# EAGLE design R204B (EAGLE 6.6.0)
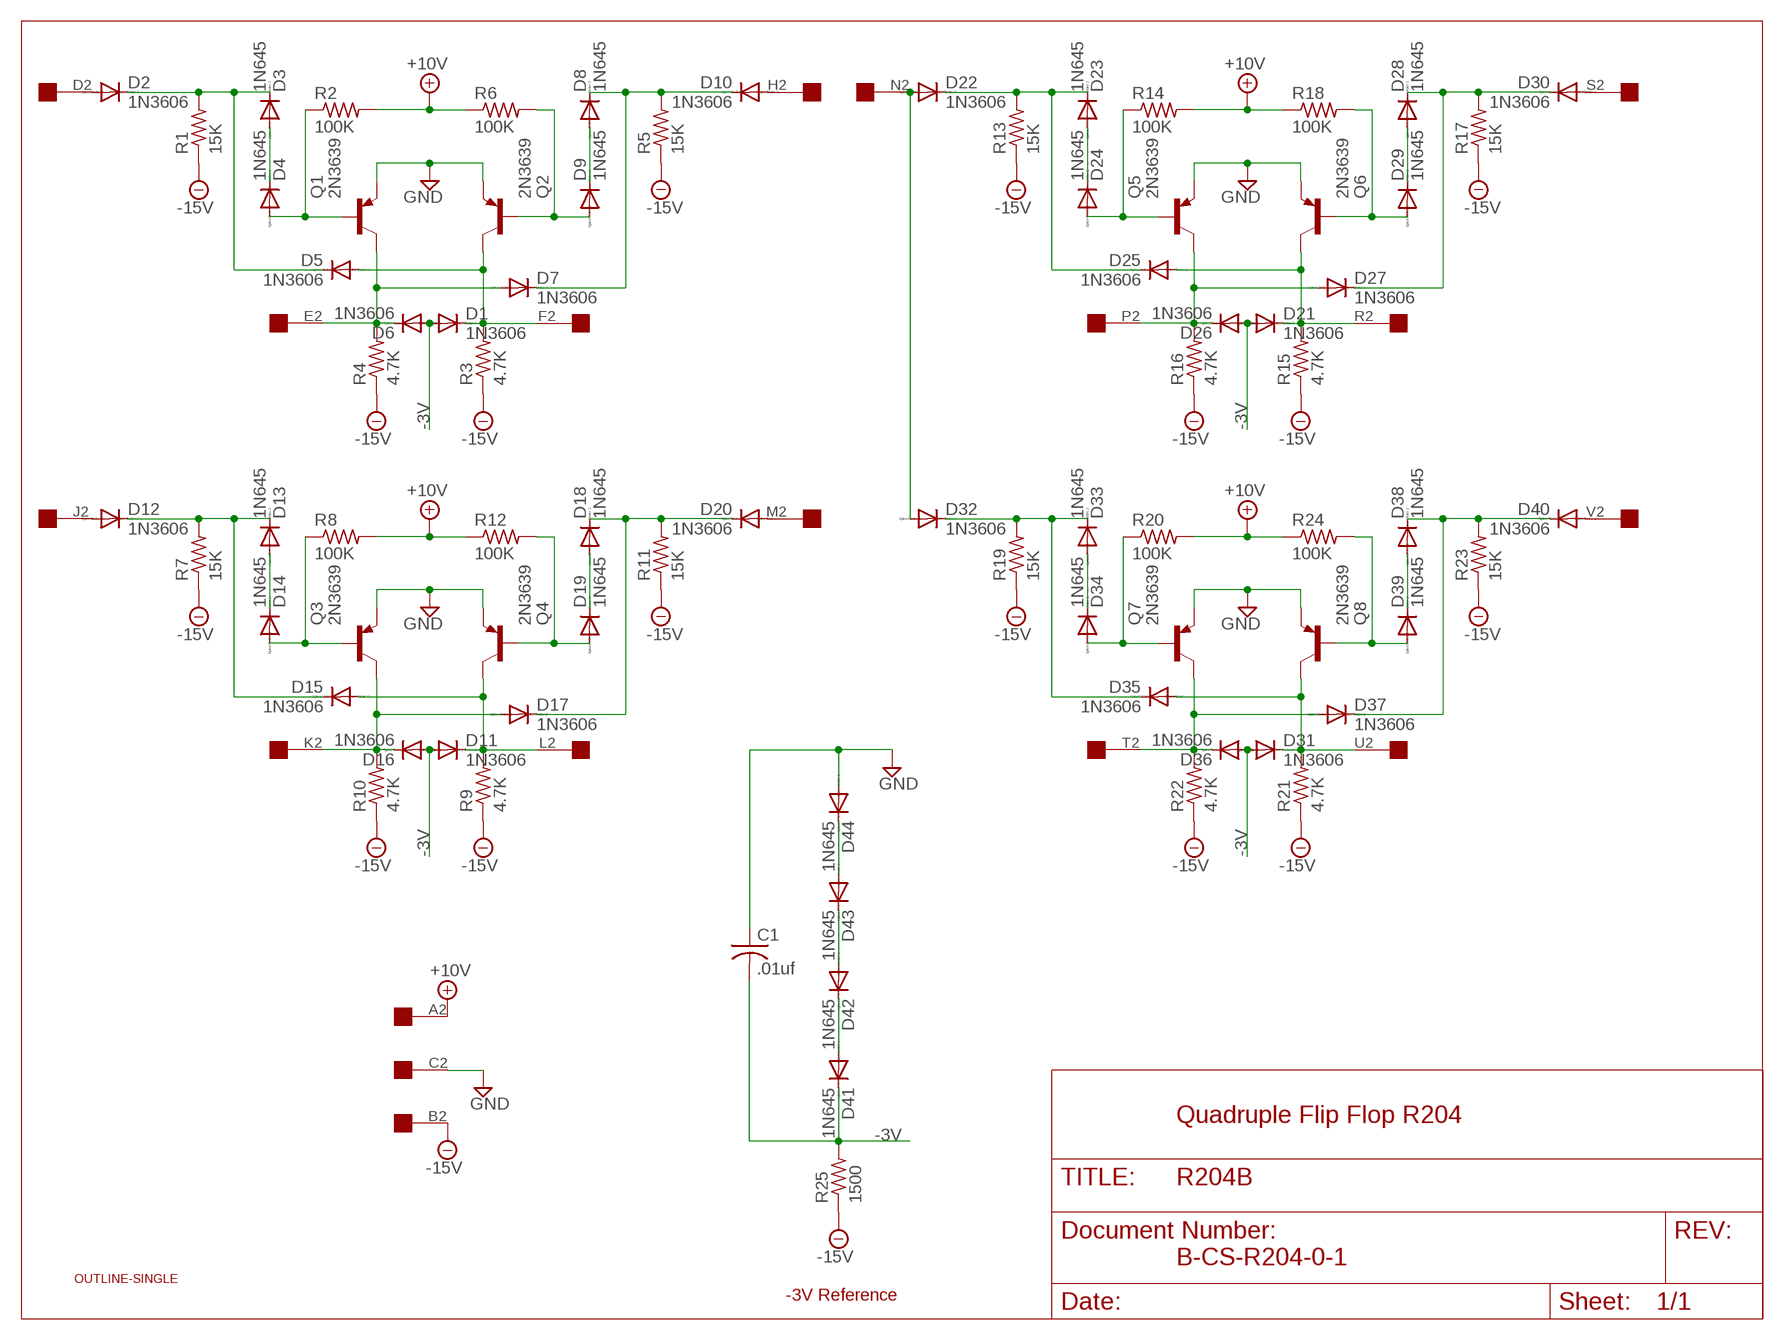
[diagram p0: schematic, sheet 1]

## Parts
C1  .01uf  C-US050-025X075  [C050-025X075]
D1  1N3606  1N4148DO35-10  [DO35-10]
D2  1N3606  1N4148DO35-10  [DO35-10]
D3  1N645  1N4148DO35-10  [DO35-10]
D4  1N645  1N4148DO35-10  [DO35-10]
D5  1N3606  1N4148DO35-10  [DO35-10]
D6  1N3606  1N4148DO35-10  [DO35-10]
D7  1N3606  1N4148DO35-10  [DO35-10]
D8  1N645  1N4148DO35-10  [DO35-10]
D9  1N645  1N4148DO35-10  [DO35-10]
D10  1N3606  1N4148DO35-10  [DO35-10]
D11  1N3606  1N4148DO35-10  [DO35-10]
D12  1N3606  1N4148DO35-10  [DO35-10]
D13  1N645  1N4148DO35-10  [DO35-10]
D14  1N645  1N4148DO35-10  [DO35-10]
D15  1N3606  1N4148DO35-10  [DO35-10]
D16  1N3606  1N4148DO35-10  [DO35-10]
D17  1N3606  1N4148DO35-10  [DO35-10]
D18  1N645  1N4148DO35-10  [DO35-10]
D19  1N645  1N4148DO35-10  [DO35-10]
D20  1N3606  1N4148DO35-10  [DO35-10]
D21  1N3606  1N4148DO35-10  [DO35-10]
D22  1N3606  1N4148DO35-10  [DO35-10]
D23  1N645  1N4148DO35-10  [DO35-10]
D24  1N645  1N4148DO35-10  [DO35-10]
D25  1N3606  1N4148DO35-10  [DO35-10]
D26  1N3606  1N4148DO35-10  [DO35-10]
D27  1N3606  1N4148DO35-10  [DO35-10]
D28  1N645  1N4148DO35-10  [DO35-10]
D29  1N645  1N4148DO35-10  [DO35-10]
D30  1N3606  1N4148DO35-10  [DO35-10]
D31  1N3606  1N4148DO35-10  [DO35-10]
D32  1N3606  1N4148DO35-10  [DO35-10]
D33  1N645  1N4148DO35-10  [DO35-10]
D34  1N645  1N4148DO35-10  [DO35-10]
D35  1N3606  1N4148DO35-10  [DO35-10]
D36  1N3606  1N4148DO35-10  [DO35-10]
D37  1N3606  1N4148DO35-10  [DO35-10]
D38  1N645  1N4148DO35-10  [DO35-10]
D39  1N645  1N4148DO35-10  [DO35-10]
D40  1N3606  1N4148DO35-10  [DO35-10]
D41  1N645  1N4148DO35-10  [DO35-10]
D42  1N645  1N4148DO35-10  [DO35-10]
D43  1N645  1N4148DO35-10  [DO35-10]
D44  1N645  1N4148DO35-10  [DO35-10]
Q1  2N3639  2N3637  [TO39]
Q2  2N3639  2N3637  [TO39]
Q3  2N3639  2N3637  [TO39]
Q4  2N3639  2N3637  [TO39]
Q5  2N3639  2N3637  [TO39]
Q6  2N3639  2N3637  [TO39]
Q7  2N3639  2N3637  [TO39]
Q8  2N3639  2N3637  [TO39]
R1  15K  R-US_0207/10  [0207/10]
R2  100K  R-US_0207/10  [0207/10]
R3  4.7K  R-US_0207/10  [0207/10]
R4  4.7K  R-US_0207/10  [0207/10]
R5  15K  R-US_0207/10  [0207/10]
R6  100K  R-US_0207/10  [0207/10]
R7  15K  R-US_0207/10  [0207/10]
R8  100K  R-US_0207/10  [0207/10]
R9  4.7K  R-US_0207/10  [0207/10]
R10  4.7K  R-US_0207/10  [0207/10]
R11  15K  R-US_0207/10  [0207/10]
R12  100K  R-US_0207/10  [0207/10]
R13  15K  R-US_0207/10  [0207/10]
R14  100K  R-US_0207/10  [0207/10]
R15  4.7K  R-US_0207/10  [0207/10]
R16  4.7K  R-US_0207/10  [0207/10]
R17  15K  R-US_0207/10  [0207/10]
R18  100K  R-US_0207/10  [0207/10]
R19  15K  R-US_0207/10  [0207/10]
R20  100K  R-US_0207/10  [0207/10]
R21  4.7K  R-US_0207/10  [0207/10]
R22  4.7K  R-US_0207/10  [0207/10]
R23  15K  R-US_0207/10  [0207/10]
R24  100K  R-US_0207/10  [0207/10]
R25  1500  R-US_0207/10  [0207/10]
U$1  OUTLINE-SINGLE  [SINGLE]
U$2  EDGE-1  [EDGE-CON1]

## Nets
+10V [Power]: R2.2 R6.1 R8.2 R12.1 R14.2 R18.1 R20.2 R24.1 U$2.A2
-0.8V: D43.A D44.C
-3V [Power]: C1.2 D1.A D6.A D11.A D16.A D21.A D26.A D31.A D36.A D41.C R25.2
-15V [Power]: R1.1 R3.1 R4.1 R5.1 R7.1 R9.1 R10.1 R11.1 R13.1 R15.1 R16.1 R17.1 R19.1 R21.1 R22.1 R23.1 R25.1 U$2.B2
E: D6.C D7.A Q1.3(C) R4.2 U$2.E2
F: D1.C D5.A Q2.3(C) R3.2 U$2.F2
GND [Power]: C1.1 D44.A Q1.1(E) Q2.1(E) Q3.1(E) Q4.1(E) Q5.1(E) Q6.1(E) Q7.1(E) Q8.1(E) U$2.C2
K: D16.C D17.A Q3.3(C) R10.2 U$2.K2
L: D11.C D15.A Q4.3(C) R9.2 U$2.L2
N$1: D13.A D14.C
N$2: D7.C D8.C D10.C R5.2
N$3: D12.C D13.C D15.C R7.2
N$4: D12.A U$2.J2
N$5: D14.A Q3.2(B) R8.1
N$6: D8.A D9.C
N$7: D10.A U$2.H2
N$8: D17.C D18.C D20.C R11.2
N$9: D2.C D3.C D5.C R1.2
N$10: D2.A U$2.D2
N$11: D18.A D19.C
N$12: D20.A U$2.M2
N$13: D42.A D43.C
N$14: D4.A Q1.2(B) R2.1
N$15: D19.A Q4.2(B) R12.2
N$16: D41.A D42.C
N$17: D9.A Q2.2(B) R6.2
N$18: D23.A D24.C
N$19: D22.C D23.C D25.C R13.2
N$20: D22.A D32.A U$2.N2
N$21: D24.A Q5.2(B) R14.1
N$22: D27.C D28.C D30.C R17.2
N$23: D3.A D4.C
N$24: D28.A D29.C
N$25: D30.A U$2.S2
N$26: D29.A Q6.2(B) R18.2
N$27: D33.A D34.C
N$28: D32.C D33.C D35.C R19.2
N$30: D34.A Q7.2(B) R20.1
N$31: D37.C D38.C D40.C R23.2
N$32: D38.A D39.C
N$33: D40.A U$2.V2
N$34: D39.A Q8.2(B) R24.2
P: D26.C D27.A Q5.3(C) R16.2 U$2.P2
R: D21.C D25.A Q6.3(C) R15.2 U$2.R2
T: D36.C D37.A Q7.3(C) R22.2 U$2.T2
U: D31.C D35.A Q8.3(C) R21.2 U$2.U2

## Notes on the sheet
- Quadruple Flip Flop R204
- B-CS-R204-0-1
- -3V Reference

## Library data of the parts
C1 = rcl:C-US: CAPACITOR, American symbol
D1-D44 = diode:1N4148: DIODE high speed (Philips)
Q1-Q8 = transistor-pnp:2N3637*: PNP Transistror
R1-R25 = rcl:R-US_: RESISTOR, American symbol
U$1 = dec-con:OUTLINE-*: Board outlines for DEC boards.
U$2 = dec-con:EDGE-1: Single-Sided DEC Edge Connector -- (side 2)

## Net classes
1 Power: width 0.813 mm

## Board
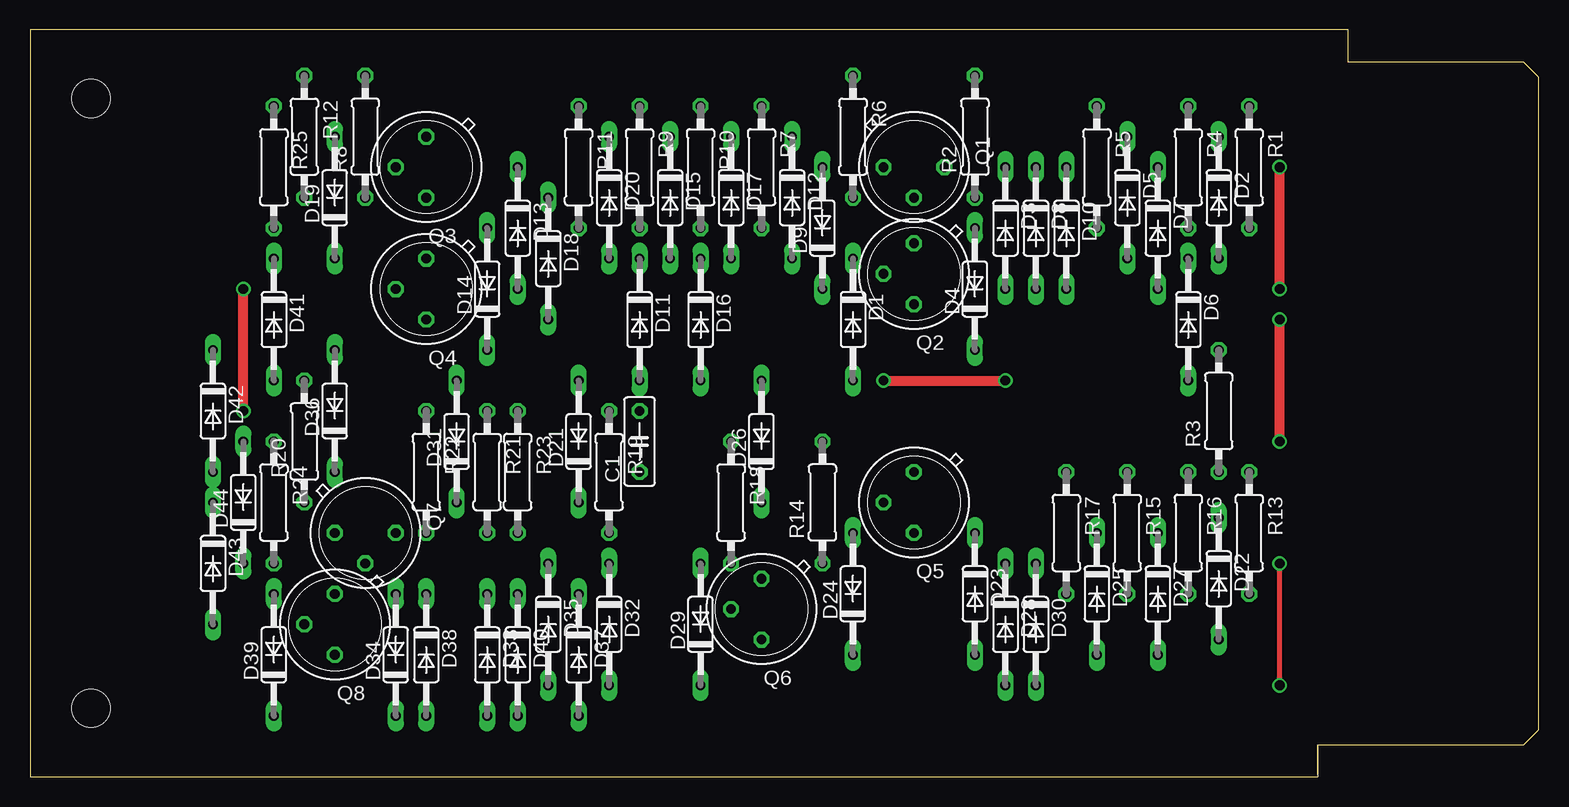
[diagram p1: board, top side]
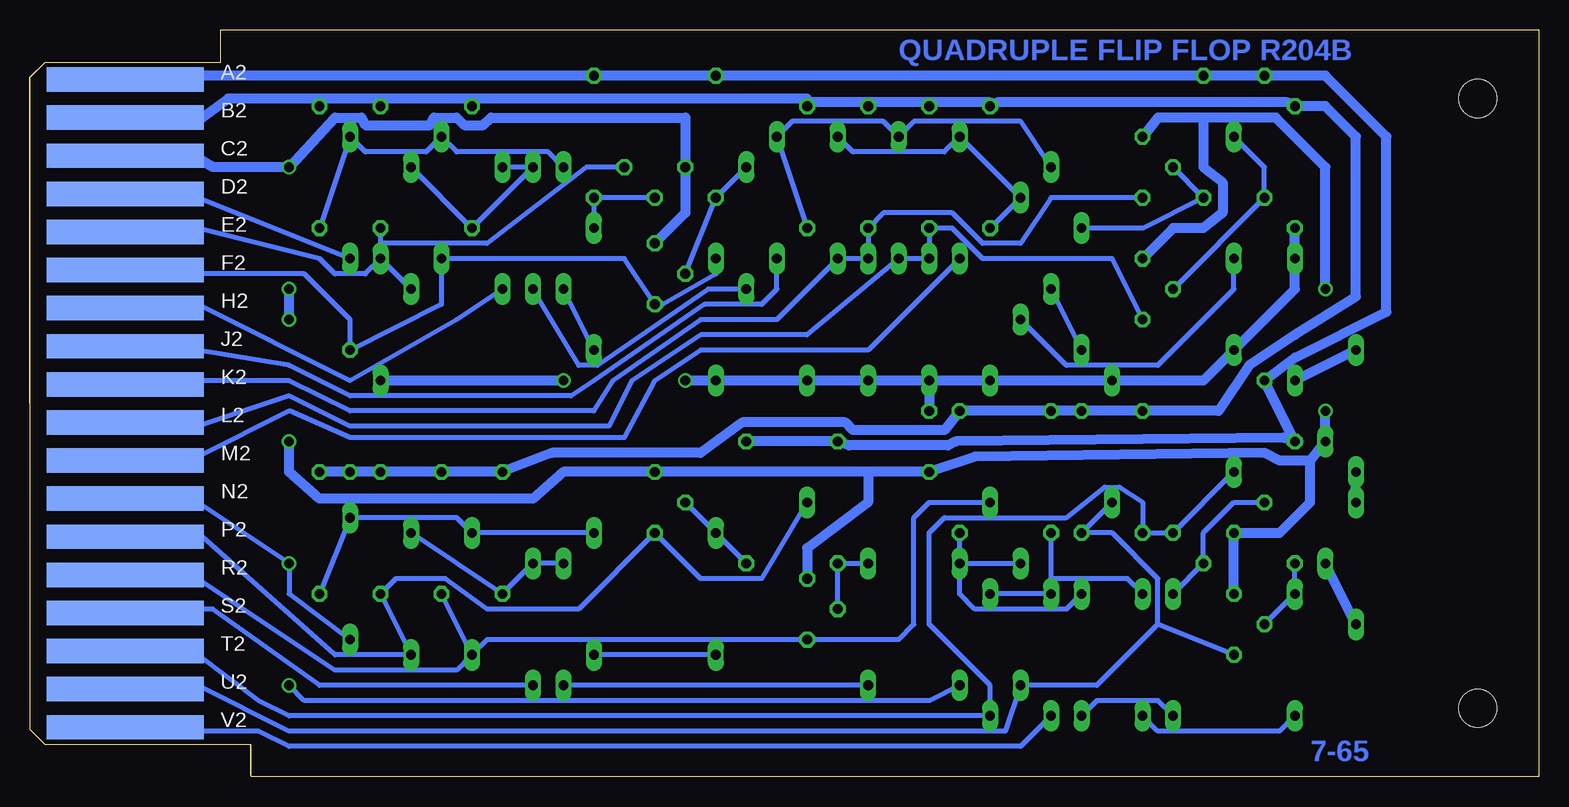
[diagram p2: board, bottom side, seen from below]

Size 125.73 x 62.23 mm. Coordinates in mm from the lower left corner, seen from the top.
Copper layers (1+16): Top 0.035mm / dielectric 1.5mm / Bottom 0.035mm
Design rules "16mils": minimum track width 16mil, minimum drill 32mil, track to track 15mil, track to pad 10mil, pad to pad 10mil, via to via 10mil, smd to smd 10mil, copper to edge 13mil, drill to drill 10mil, minimum pad ring 10mil, minimum via ring 8mil, stop-mask expansion 0mil, vias tented up to drill 0mil, thermal gap 10mil

### Footprints (pad centres in the part's own frame; a part is rotated, then mirrored left to right if it is on the bottom)
C050-025X075 = drill 0.813 octagon: 1 -2.54,0; 2 2.54,0
DO35-10 = drill 0.813 long: A 5.08,0; C -5.08,0
TO39 = drill 0.813 octagon: 1 0,-2.54; 2 2.54,0; 3 0,2.54
0207/10 = drill 0.813 octagon: 1 -5.08,0; 2 5.08,0
SINGLE = hole 3.175: 120.65,56.515; 120.65,5.715
EDGE-CON1 = smd 13.106 x 2.032 bottom: A2 7.938,4.128; B2 7.938,7.303; C2 7.938,10.477; D2 7.938,13.652; E2 7.938,16.828; F2 7.938,20.003; H2 7.938,23.177; J2 7.938,26.352; K2 7.938,29.527; L2 7.938,32.703; M2 7.938,35.877; N2 7.938,39.053; P2 7.938,42.227; R2 7.938,45.403; S2 7.938,48.578; T2 7.938,51.752; U2 7.938,54.928; V2 7.938,58.102

### Placement (x,y rotation side)
C1  50.8,27.94 90 top
D1  68.58,38.1 270 top
D2  99.06,48.26 270 top
D3  81.28,45.72 270 top
D4  78.74,40.64 90 top
D5  91.44,48.26 270 top
D6  96.52,38.1 270 top
D7  93.98,45.72 270 top
D8  83.82,45.72 270 top
D9  66.04,45.72 90 top
D10  86.36,45.72 270 top
D11  50.8,38.1 270 top
D12  63.5,48.26 270 top
D13  40.64,45.72 270 top
D14  38.1,40.64 90 top
D15  53.34,48.26 270 top
D16  55.88,38.1 270 top
D17  58.42,48.26 270 top
D18  43.18,43.18 270 top
D19  25.4,48.26 90 top
D20  48.26,48.26 270 top
D21  45.72,27.94 90 top
D22  99.06,16.51 270 top
D23  78.74,15.24 270 top
D24  68.58,15.24 90 top
D25  88.9,15.24 270 top
D26  60.96,27.94 90 top
D27  93.98,15.24 270 top
D28  81.28,12.7 270 top
D29  55.88,12.7 90 top
D30  83.82,12.7 270 top
D31  35.56,27.94 90 top
D32  48.26,12.7 270 top
D33  38.1,10.16 270 top
D34  30.48,10.16 90 top
D35  43.18,12.7 270 top
D36  25.4,30.48 90 top
D37  45.72,10.16 270 top
D38  33.02,10.16 270 top
D39  20.32,10.16 90 top
D40  40.64,10.16 270 top
D41  20.32,38.1 270 top
D42  15.24,30.48 270 top
D43  15.24,17.78 270 top
D44  17.78,22.86 90 top
Q1  73.66,50.8 270 top
Q2  73.66,41.91 180 top
Q3  33.02,50.8 180 top
Q4  33.02,40.64 180 top
Q5  73.66,22.86 180 top
Q6  60.96,13.97 180 top
Q7  27.94,20.32 270 top
Q8  25.4,12.7 180 top
R1  101.6,50.8 270 top
R2  78.74,53.34 90 top
R3  99.06,30.48 90 top
R4  96.52,50.8 270 top
R5  88.9,50.8 270 top
R6  68.58,53.34 270 top
R7  60.96,50.8 270 top
R8  27.94,53.34 90 top
R9  50.8,50.8 270 top
R10  55.88,50.8 270 top
R11  45.72,50.8 270 top
R12  22.86,53.34 270 top
R13  101.6,20.32 270 top
R14  66.04,22.86 90 top
R15  91.44,20.32 270 top
R16  96.52,20.32 270 top
R17  86.36,20.32 270 top
R18  58.42,22.86 270 top
R19  48.26,25.4 270 top
R20  22.86,27.94 90 top
R21  38.1,25.4 270 top
R22  33.02,25.4 270 top
R23  40.64,25.4 270 top
R24  20.32,22.86 270 top
R25  20.32,50.8 270 top
U$1  125.73,62.23 180 top
U$2  125.73,62.23 180 top

### Tracks (layer width: path | path; a pad name or v marks a point on that pad's centre or on a via)
+10V
  Bottom 0.813: R12.1 R8.2 | R12.1 R6.1 R2.2 111.76,58.42 112.14,58.04 U$2.A2 | R14.2 R18.1 57.47,27.62 49.21,27.62 48.58,27.94 21.27,28.26 R24.1 | R24.1 R20.2 20.32,34.92 12.7,38.73 12.7,53.34 17.78,58.42 R12.1 | 20,27.94 R24.1
-0.8V
  Bottom 0.813: D43.A D44.C
-3V  (via drill 0.81)
  Top 0.813: v71.12,33.02 v81.28,33.02
  Bottom 0.813: v71.12,33.02 D1.A D26.A D16.A D11.A | v81.28,33.02 D6.A | D11.A C1.2 | D11.A D21.A D31.A 27.94,33.02 D36.A 20.32,40.64 D41.C R25.2
-15V
  Bottom 0.813: U$2.B2 111.76,54.9 111.76,54.61 109.22,56.52 101.6,56.52 | 96.52,56.52 101.6,56.52 | 101.6,56.52 R1.1 | 88.9,56.52 96.52,56.52 | 96.52,56.52 R4.1 | 60.96,56.2 60.96,56.52 88.9,56.52 | 88.9,56.52 R5.1 | 55.88,56.2 60.96,56.2 | 60.96,56.2 R7.1 | 50.8,56.2 55.88,56.2 | 55.88,56.2 R10.1 | 50.8,56.2 45.72,56.2 R11.1 45.09,56.2 20.95,56.2 R25.1 17.78,55.88 15.24,53.34 15.24,40.01 20.32,36.83 24.13,34.29 26.67,30.48 R22.1 R21.1 R23.1 R19.1 49.53,28.89 57.15,28.89 57.78,29.53 66.36,29.53 69.85,26.99 82.23,26.99 R17.1 R15.1 R16.1 R3.1 R13.1 | 50.8,56.2 R9.1
E
  Bottom 0.406: U$2.E2 111.76,45.72 101.6,43.18 100.33,41.91 97.79,41.91 D6.C | 96.52,44.45 D6.C | 96.52,44.45 R4.2 | D6.C D7.A | Q1.3 79.38,50.8 87.63,44.45 96.52,44.45
F
  Bottom 0.406: U$2.F2 111.76,41.91 102.87,41.91 99.06,38.1 R3.2 91.44,39.37 D5.A 76.2,43.18 Q2.3 73.03,39.37 68.58,41.91 D1.C
GND  (via drill 0.81)
  Top 0.813: v104.14,40.64 v104.14,50.8 | v104.14,27.94 v104.14,38.1 | v17.78,30.48 v17.78,40.64
  Bottom 0.813: U$2.C2 112.09,51.74 110.49,50.8 v104.14,50.8 100.33,54.93 98.11,54.93 97.79,54.29 92.39,54.29 92.08,54.93 90.17,54.93 89.53,54.29 87.95,54.29 87.31,54.93 71.12,54.93 Q1.1 71.12,46.99 Q2.1 | v104.14,38.1 v104.14,40.64 | v17.78,30.48 D44.A 19.05,26.35 | v17.78,40.64 17.78,50.8 21.91,54.93 27.94,54.93 | 27.94,54.93 31.75,54.93 Q3.1 | Q4.1 30.48,45.72 27.94,45.72 26.35,46.99 26.35,49.53 27.94,50.8 27.94,54.93 | v104.14,27.94 104.14,25.4 101.6,23.18 83.82,23.18 81.28,25.4 Q5.1 55.88,25.4 | 55.88,25.4 C1.1 46.99,26.67 22.86,26.99 21.59,26.35 19.05,26.35 | Q6.1 60.96,19.05 55.88,22.86 55.88,25.4 | Q8.1 Q7.1 21.59,20.32 19.05,22.86 19.05,26.35
K
  Bottom 0.406: U$2.K2 111.76,33.02 104.14,33.02 99.06,30.48 78.74,30.48 77.15,33.02 69.85,38.1 63.5,38.1 D17.A D16.C R10.2 54.61,46.99 48.9,46.99 46.35,44.45 43.18,44.45 40.64,48.26 Q3.3
L
  Bottom 0.406: U$2.L2 111.76,29.21 104.14,31.75 99.06,29.21 77.47,29.21 75.56,33.02 69.85,36.83 60.96,36.83 D15.A D11.C R9.2 48.9,45.72 46.35,43.18 35.56,43.18 Q4.3
N$1
  Bottom 0.406: D14.C D13.A
N$2
  Bottom 0.406: D10.C D8.C R5.2 D7.C
N$3
  Bottom 0.406: R7.2 D12.C 62.23,54.61 54.61,54.61 D15.C 52.07,54.61 43.18,54.61 D13.C
N$4
  Bottom 0.406: U$2.J2 111.76,35.56 104.14,34.29 99.06,31.75 80.64,31.75 78.74,33.02 69.53,39.37 64.77,39.37 63.5,40.64 D12.A
N$5
  Bottom 0.406: D14.A 33.02,45.72 R8.1 Q3.2
N$6
  Bottom 0.406: D9.C 69.22,40.64 78.42,34.29 80.01,34.29 D8.A
N$7
  Bottom 0.406: U$2.H2 111.76,39.37 99.06,33.02 90.17,38.1 D10.A
N$8
  Bottom 0.406: R11.2 D18.C D20.C 49.53,52.07 57.15,52.07 D17.C
N$9
  Bottom 0.406: R1.2 D2.C 97.79,52.07 92.71,52.07 D5.C 90.17,52.07 82.55,52.07 D3.C
N$10
  Bottom 0.406: U$2.D2 111.76,48.26 D2.A
N$11
  Bottom 0.406: D19.C 25.4,40.64 31.75,34.29 39.37,34.29 D18.A
N$12
  Bottom 0.406: U$2.M2 111.76,26.67 104.14,30.48 99.06,28.26 76.2,28.26 73.66,33.02 69.85,35.56 55.88,35.56 D20.A
N$13
  Bottom 0.813: D43.C D42.A
N$14
  Bottom 0.406: D4.A R2.1 Q1.2
N$15
  Bottom 0.406: Q4.2 R12.2 22.86,50.8 D19.A
N$16
  Bottom 0.813: D42.C D41.A
N$17
  Bottom 0.406: D9.A R6.2 Q2.2
N$18
  Bottom 0.406: D24.C D23.A
N$19
  Bottom 0.406: R13.2 D22.C 90.17,21.59 D25.C D23.C
N$20  (via drill 0.81)
  Top 0.406: v104.14,7.62 v104.14,17.78
  Bottom 0.406: U$2.N2 111.76,22.86 v104.14,17.78 104.14,15.24 D22.A | D32.A 50.8,6.35 102.87,6.35 v104.14,7.62
N$21
  Bottom 0.406: R14.1 D24.A Q5.2
N$22
  Bottom 0.406: D27.C R17.2 D30.C D28.C
N$23
  Bottom 0.406: D4.C D3.A
N$24
  Bottom 0.406: D29.C D28.A
N$25
  Bottom 0.406: D30.A 101.6,7.62 110.49,13.97 113.03,13.97 U$2.S2
N$26
  Bottom 0.406: D29.A R18.2 Q6.2
N$27
  Bottom 0.406: D34.C 31.75,6.35 36.83,6.35 D33.A
N$28
  Bottom 0.406: D32.C D35.C | D32.C R19.2 | D33.C 39.37,13.97 46.99,13.97 48.26,15.24 D32.C
N$30
  Bottom 0.406: D34.A Q7.2 27.94,20.32 25.4,22.86 R20.1
N$31
  Bottom 0.406: D37.C D40.C 40.64,16.51 | 40.64,16.51 R23.2 | D38.C 34.29,16.51 40.64,16.51
N$32
  Bottom 0.406: D39.C 21.59,3.81 31.75,3.81 D38.A
N$33
  Bottom 0.406: D40.A 43.18,2.54 104.14,2.54 106.68,3.81 111.76,3.81 U$2.V2
N$34
  Bottom 0.406: Q8.2 D39.A R24.2
P
  Bottom 0.406: U$2.P2 111.76,20.32 100.33,10.16 D27.A R16.2 95.25,16.51 91.12,16.51 87.63,13.97 80.01,13.97 Q5.3 69.85,16.51 64.77,16.51 D26.C
R
  Bottom 0.406: U$2.R2 111.76,16.51 100.33,8.89 90.17,8.89 D25.A | D25.A R15.2 | D25.A 87.63,11.43 Q6.3 53.34,11.43 52.07,12.7 52.07,21.59 50.8,22.86 D21.C
T
  Bottom 0.406: U$2.T2 111.76,10.16 106.68,6.35 104.14,5.08 D37.A 45.72,7.62 50.8,12.7 50.8,20.32 49.53,21.59 39.37,21.59 36.2,24.13 34.92,24.13 33.02,22.86 R22.2 Q7.3 D36.C
U
  Bottom 0.406: U$2.U2 111.76,7.62 104.14,3.81 44.45,3.81 D35.A 36.83,7.62 31.75,12.7 | Q8.3 31.75,12.7 | 31.75,12.7 31.75,16.51 35.56,20.32 R21.2 D31.C

### Text on the board
Bottom: QUADRUPLE FLIP FLOP R204B | 7-65